# Altium schematic sheet Main.SchDoc
size 203 x 127 mm
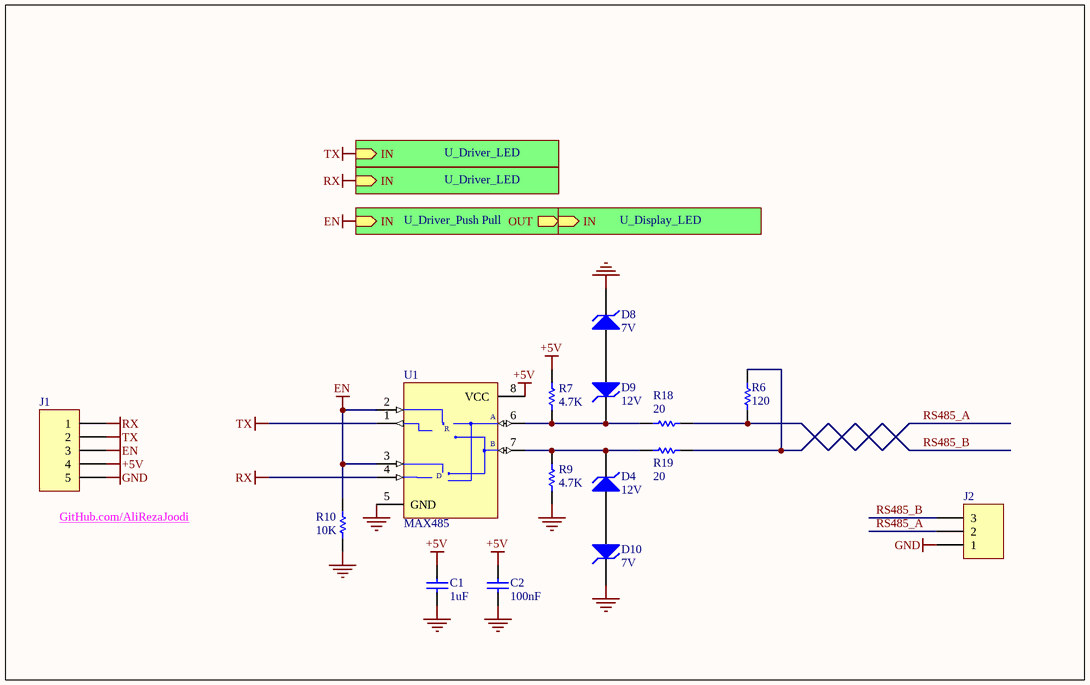
[diagram p0: Main.SchDoc]

## Parts
C1  1uF  [0805]
C2  100nF  [0805]
D4  12V  [ZENER_DIODE]
D8  7V  [ZENER_DIODE]
D9  12V  [ZENER_DIODE]
D10  7V  [ZENER_DIODE]
J1  Header 5  [HDR1X5]  (value not drawn)
J2  Header 3  [HDR1X3]  (value not drawn)
R6  120  [0805]
R7  4.7K  [0805]
R9  4.7K  [0805]
R10  10K  [0805]
R18  20  [0805]
R19  20  [0805]
U1  MAX485  [SOP127P636-8N]

## Sub-sheets
U_Display_LED = Display_LED.SchDoc: IN (in)
U_Driver_LED = Driver_LED.SchDoc: IN (in)
U_Driver_LED = Driver_LED.SchDoc: IN (in)
U_Driver_Push Pull = Driver_Push Pull.SchDoc: IN (in), OUT (out)

## Nets
+5V: C1.2 C2.2 J1.4 R7.1 U1.8(VCC)
EN: J1.3 R10.2 U1.2(~{RE}) U1.3(DE) ; sheet U_Driver_Push Pull/IN
GND: C1.1 C2.1 D8.2(K) D10.2(K) J1.5 J2.1 R9.2 R10.1 U1.5(GND)
RX: J1.1 U1.4(DI) ; sheet U_Driver_LED/IN
TX: J1.2 U1.1(RO) ; sheet U_Driver_LED/IN
RS485_A: J2.2 R6.1 R18.1
RS485_B: J2.3 R6.2 R19.1
NetD4_1: D4.1(A) D10.1(A)
NetD4_2: D4.2(K) R9.1 R19.2 U1.7(B)
NetD8_1: D8.1(A) D9.1(A)
NetD9_2: D9.2(K) R7.2 R18.2 U1.6(A)
(unnamed): sheet U_Driver_Push Pull/OUT, sheet U_Display_LED/IN

## Notes on the sheet
- (near J1) GitHub.com/AliRezaJoodi
- (in symbol MAX485CPA) R; D

## Library data of the parts
C1 C2 = Cap: Capacitor; Manufacturer: Generic Components; Class I: Passive; Published: 8-Jun-2000; Revision: July-2002: Re-released for DXP Platform.; Publisher: Altium Limited; Class II: Capacitor
D4 D8-D10 = D Zener: Zener Diode; Manufacturer: Generic Components; Class I: Discrete; Class II: Diode - Zener; Published: 8-Jun-2000; Revision: July-2002: Re-released for DXP Platform.; Publisher: Altium Limited
J1 = Header 5: Header, 5-Pin; Manufacturer: Generic Components; Class I: Connector; Revision: July-2002: Re-released for DXP Platform.; Publisher: Altium Limited
J2 = Header 3: Header, 3-Pin; Manufacturer: Generic Components; Class I: Connector; Revision: July-2002: Re-released for DXP Platform.; Publisher: Altium Limited
R6 R7 R9 R10 R18 R19 = Res1: Resistor; Published: 8-Jun-2000; LatestRevisionDate: 17-Jul-2002; LatestRevisionNote: Re-released for DXP Platform.; PackageReference: AXIAL-0.3; Publisher: Altium Limited
U1 = MAX485CPA: Low-Power, Slew-Rate-Limited RS-485/RS-422 Transceiver; Published: 16-Jan-2001; LatestRevisionDate: 29-May-2009; LatestRevisionNote: Component Body Added.; DatasheetVersion: Feb-1996; PackageVersion: RevB, 21-0043; PackageReference: PA8; Publisher: Altium Limited; PackageDescription: DIP, 8-Pin, Row Spacing 7.62 mm, Pitch 2.54 mm; Code_JEDEC: MS-001-AB; ComponentLink1Description: Manufacturer Link; ComponentLink1URL: http://www.maxim-ic.com/; ComponentLink2Description: Datasheet; ComponentLink2URL: http://pdfserv.maxim-ic.com/en/ds/MAX1487-MAX491.pdf